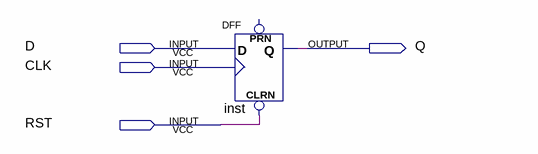
[diagram p0: schematic sheet]
// Quartus schematic CURRENTSTATE.bdf as structural Verilog: 1 symbols, 4 pins
module CURRENTSTATE (
  input  D,
  input  CLK,
  input  RST,
  output Q
);

  DFF inst (.CLRN(RST), .CLK(CLK), .D(D), .Q(Q));  // open: PRN
endmodule
